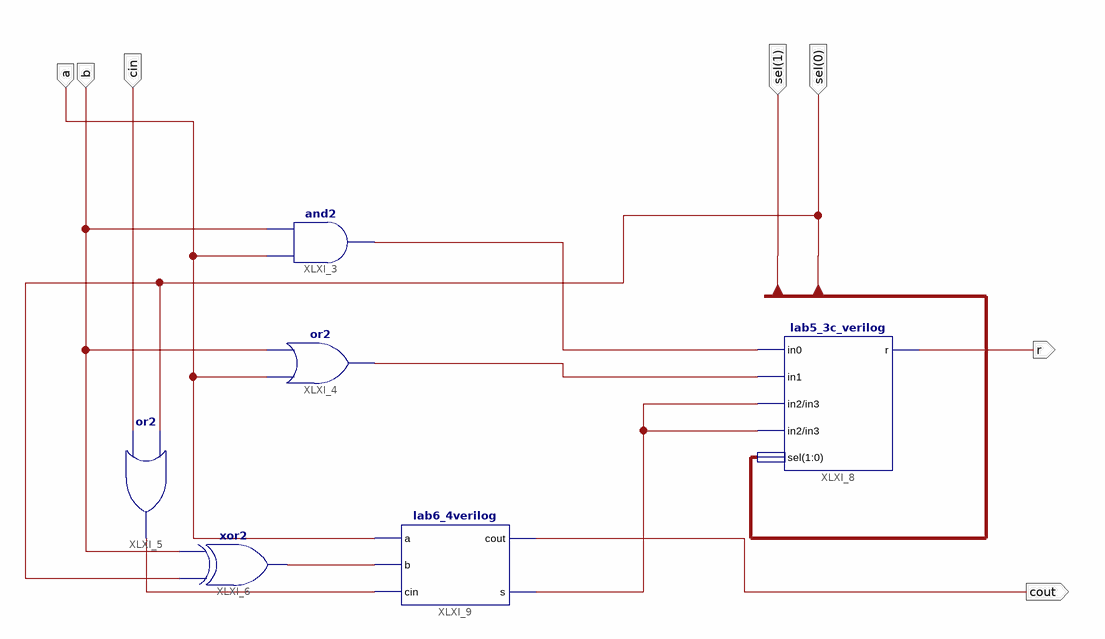
[diagram p0: schematic sheet 1]
// Xilinx ISE schematic lab7_2_sch.sch (artix7) as structural Verilog: 6 symbols, 7 ports
module lab7_2_sch (
  input  b,
  input  [1:0] sel,
  input  a,
  input  cin,
  output r,
  output cout
);

  wire XLXN_8, XLXN_9, XLXN_16, XLXN_20, XLXN_23;

  and XLXI_3 (XLXN_9, a, b);
  or XLXI_4 (XLXN_8, a, b);
  or XLXI_5 (XLXN_20, cin, sel[0]);
  xor XLXI_6 (XLXN_16, sel[0], b);
  lab5_3c_verilog XLXI_8 (.in0(XLXN_9), .in1(XLXN_8), .in2(XLXN_23), .in3(XLXN_23), .sel(sel), .r(r));
  lab6_4verilog XLXI_9 (.a(a), .b(XLXN_16), .cin(XLXN_20), .cout(cout), .s(XLXN_23));
endmodule
